# Altium schematic sheet LMR514205V.SchDoc
size A; SheetNumber: 10; SheetTotal: 16
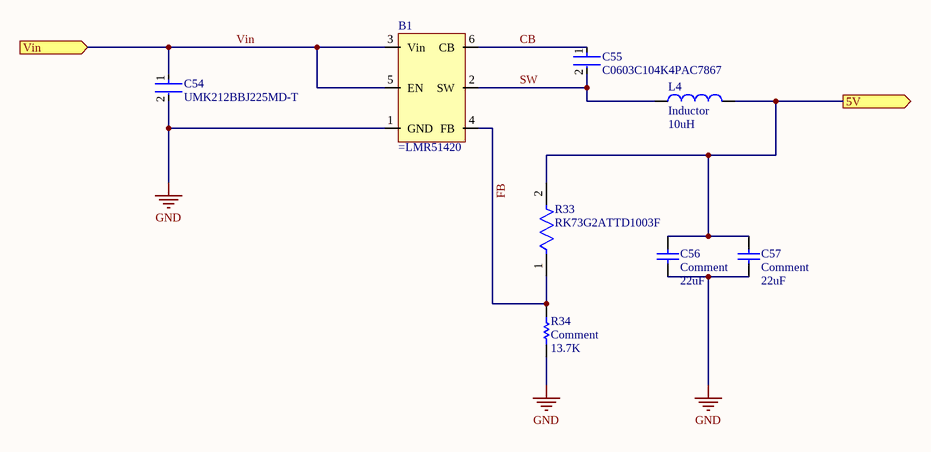
[diagram p0: LMR514205V.SchDoc]

## Parts
B1  (no value)  [PCBComponent_1]
C54  UMK212BBJ225MD-T  [FP-0805-L_2_0_0_2-W_1_25-IPC_A]
C55  C0603C104K4PAC7867  [FP-C0603C-CF-MFG]
C56  Comment  value 22uF  [Cap22uF_C1206C226M4PAC7800]
C57  Comment  value 22uF  [Cap22uF_C1206C226M4PAC7800]
L4  Inductor  value 10uH  [0402-A]
R33  RK73G2ATTD1003F  [FP-RK73G2A-IPC_A]
R34  Comment  value 13.7K  [RMCF0805FT13K7_13.7k]

## Ports
5V (out), Vin (in)

## Nets
GND: B1.1(GND) C54.2 C56.1 C57.1 R34.1
5V: C56.2 C57.2 L4.2 R33.2 ; port 5V
CB: B1.6(CB) C55.1
FB: B1.4(FB) R33.1 R34.2
SW: B1.2(SW) C55.2 L4.1
Vin: B1.3(Vin) B1.5(EN) C54.1 ; port Vin

## Library data of the parts
B1 = Component_1
C54 = CMP-14477-004278-2: Multilayer Ceramic Capacitor 2.2uF 50V X5R 20% SMD 0803 T/R; Max Operating Temperature: 85°C; Tolerance: 20%; Case Code (Imperial): 0805; Case/Package: 0805; Case Code (Metric): 2012; Capacitance: 2.2uF; Min Operating Temperature: -55°C; Mount: Surface Mount; Voltage Rating: 50V; Packaging: Tape and Reel; RoHS Compliant: Yes
C55 = CMP-03020-002384-2: CAP CER 0.1UF 16V X5R 0603; Manufacturer: KEMET; Automotive Grade: Grade 1; Value: 0.10 μF; Material: Ceramic; Temperature Coefficient: 30ppm/°C; Tolerance: 0.1; Manufacturer Part Number: C0603C104K4PAC7867; Automotive: Yes; Octopart: https://octopart.com/c0603c104k4pactu-kemet-12592163; Device Class L2: Capacitors; ComponentLink2URL: https://api.kemet.com/component-edge/download/datasheet/C0603C100J5GACAUTO.pdf; RoHS: TRUE; Height: 0.87mm; Temperature Characteristic: X5R; Voltage Rating: 16 V; Device Class L1: Passive Components; Category: Cap; Digikey Description: CAP CER 0.1UF 16V X5R 0603; Temperature Range High: +125°C; Package: C0603C-CF; Device Class L3: Ceramic Capacitors; Lead Free: Yes; Temperature: -55°C to +125°C; Temperature Range Low: -55°C; Capacitance: 0.10 μF; ComponentLink2Description: Datasheet
C56 C57 = Cap: Capacitor; Published: 8-Jun-2000; LatestRevisionDate: 17-Jul-2002; LatestRevisionNote: Re-released for DXP Platform.; PackageReference: RAD-0.3; Publisher: Altium Limited; PackageDescription: Radial Cap, Thru-Hole; 2 Leads; 0.3 in Pin Spacing
L4 = Inductor: Code_IEC: 1005; Published: 8-Jun-2000; LatestRevisionDate: 29-May-2009; LatestRevisionNote: IPC-7351 Footprint Added.; PackageReference: 0402-A; Publisher: Altium Limited; PackageDescription: Chip Inductor; Code_JEITA: 0402
R33 = CMP-04015-080178-1: 100kΩ ±1% 0.125W Chip Resistor 0805 Thick Film AEC-Q200 Qualified; Voltage Rating: 150V; Power Rating: 125mW; Temperature Coefficient: 50ppm/°C; Resistance: 100kR; Series: RK73G; Termination: SMD/SMT; Packaging: Tape and Reel; Tolerance: 1%; Case Code (Imperial): 0805; RoHS Compliant: Yes; Max Operating Temperature: 125°C; Min Operating Temperature: -55°C; Case Code (Metric): 2012
R34 = Res1: Resistor; Published: 8-Jun-2000; LatestRevisionDate: 17-Jul-2002; LatestRevisionNote: Re-released for DXP Platform.; PackageReference: AXIAL-0.3; Publisher: Altium Limited; PackageDescription: Axial Device, Thru-Hole; 2 Leads; 0.3 in Pin Spacing